# EAGLE design MinieasySens-RS485_V12-Build015 (EAGLE 7.6.0)
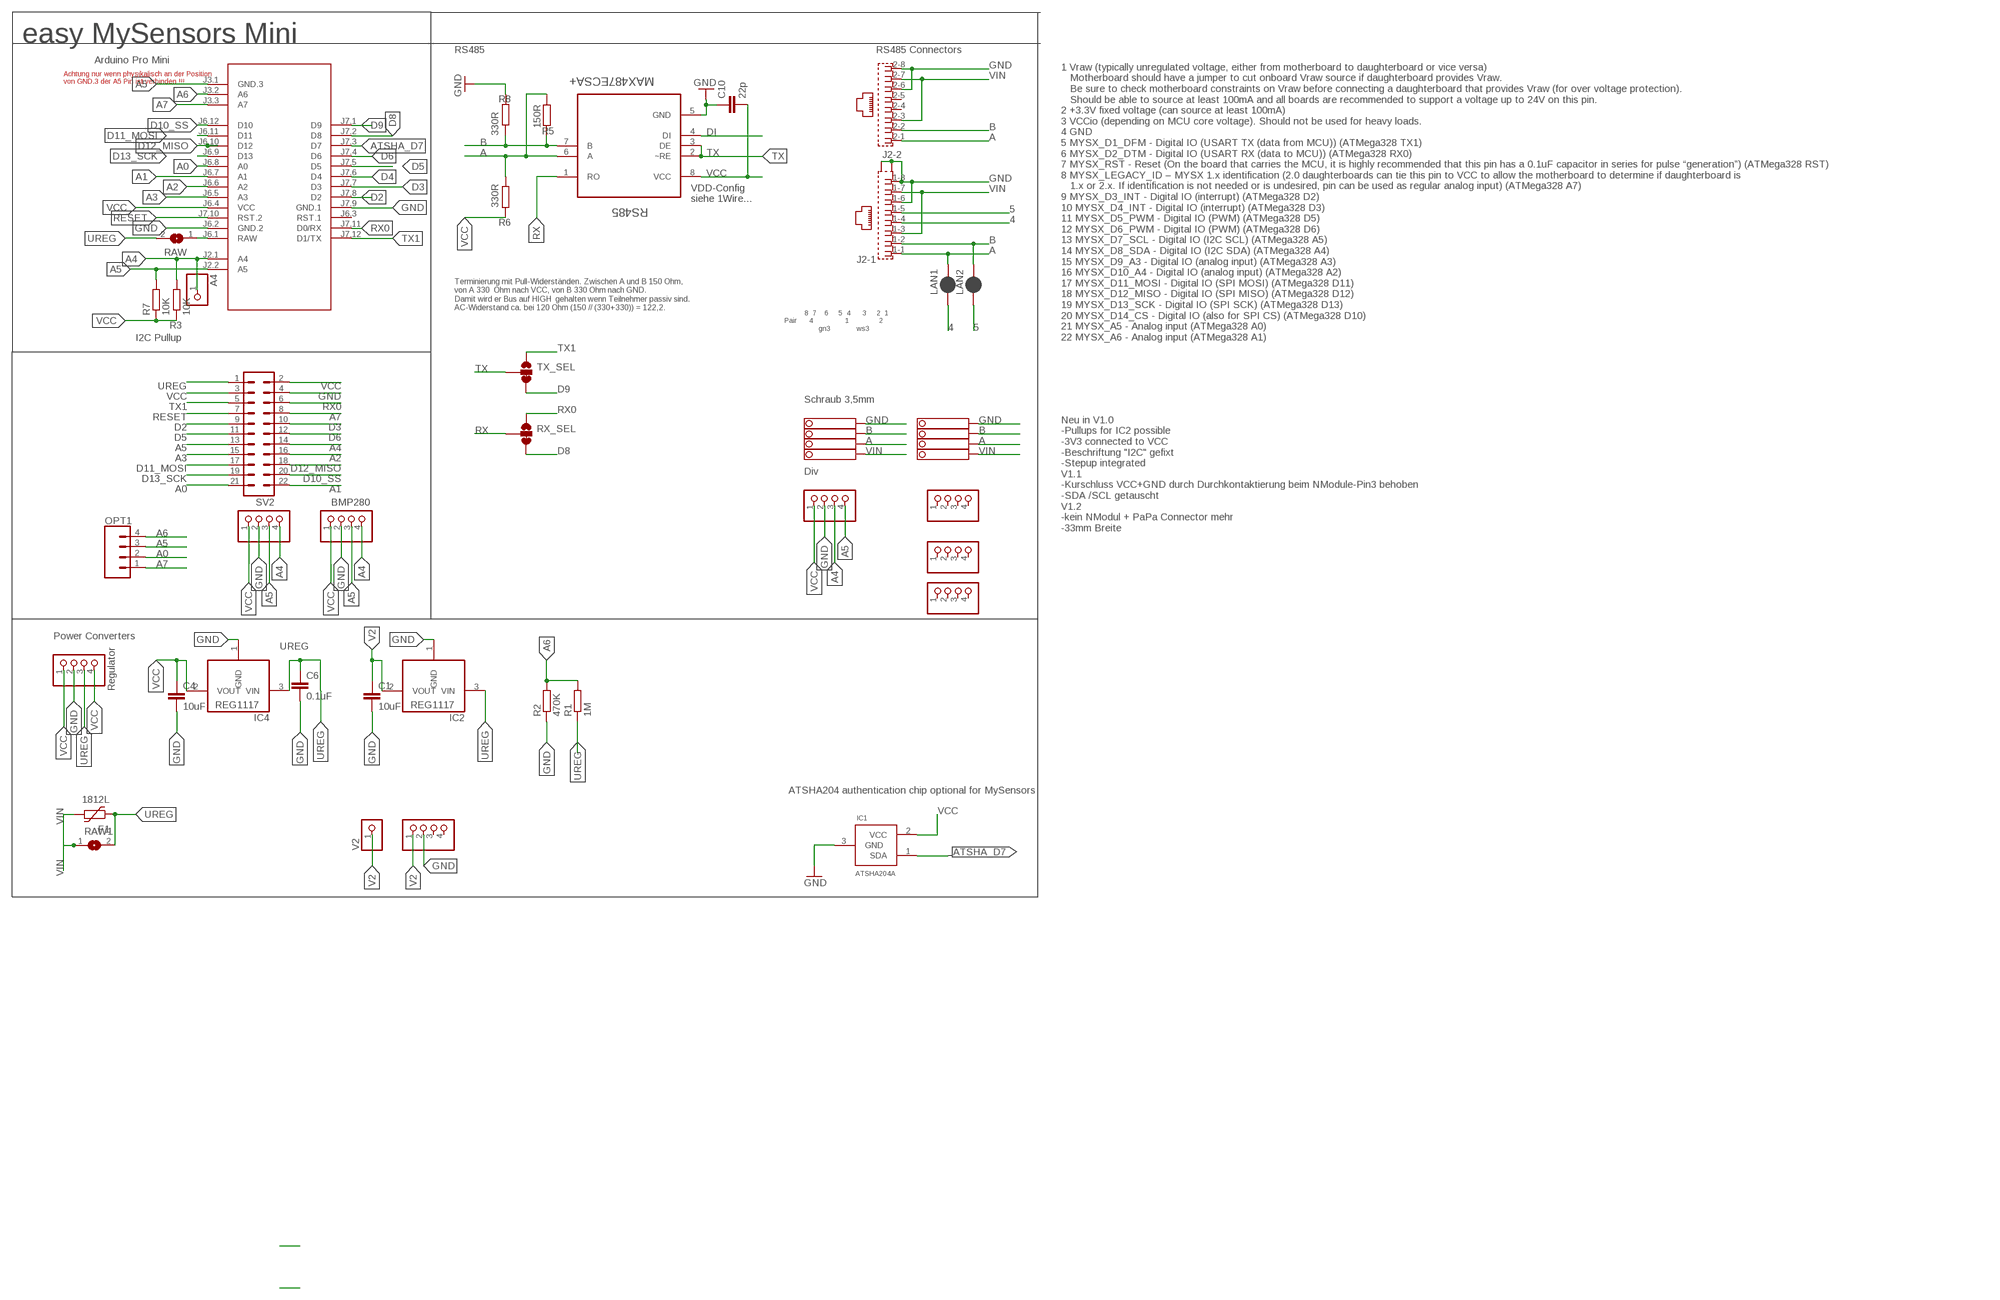
[diagram p0: schematic, sheet 1]

## Parts
A4  PINHD-1X1  [1X01]
BH1750  PINHD-1X04_2.54-S  [1X04-S]
C1  10uF  C-EUC1210  [C1210]
C4  10uF  C-EUC1210  [C1210]
C6  0.1uF  C-EUC1206  [C1206]
C10  22p  C-EUC0805  [C0805]
F1  1812L  [1812L]
I2C-1  PINHD-1X04_2.54-S  [1X04-S]
I2C-2  PINHD-1X04_2.54-S  [1X04-S]
IC1  ATSHA204A  [SOT23]
IC2  REG1117  [SOT223]
IC4  REG1117  [SOT223]
J2  RJ45_2X_NARROW_SHILDPINS_NOCASE  [RJ45_2X_NARROW_SHILDPINS_NOCASE]
JP1  PINHD-1X04_2.54-S  [1X04-S]
JP2  PINHD-1X04_2.54-S  [1X04-S]
JP4  PINHD-1X04_2.54-S  [1X04-S]
LAN1  JUMPER-SMT_2_NC_PASTE_SILK  [SMT-JUMPER_2_NC_PASTE_SILK]
LAN2  JUMPER-SMT_2_NC_PASTE_SILK  [SMT-JUMPER_2_NC_PASTE_SILK]
M1  ARDUINO-PRO-MINI-3.3V#NP  [ARDUINO-PRO-MINI#NP]
OPT1  CONN_04  [1X04]
R1  1M  R-EU_R0805  [R0805]
R2  470K  R-EU_R0805  [R0805]
R3  10K  R-EU_R0805  [R0805]
R5  150R  R-EU_R0805  [R0805]
R6  330R  R-EU_R0805  [R0805]
R7  10K  R-EU_R0805  [R0805]
R8  330R  R-EU_R0805  [R0805]
RAW  SJ  [SJ]
RAW1  SJ  [SJ]
RS485  MAX487ECSA+  [SOIC127P600X175-8N]
RX_SEL  JUMPER-SMT_3_1-NC_TRACE_SILK  [SMT-JUMPER_3_1-NC_TRACE_SILK]
STEPDWN  PINHD-1X04_2.54-S  [1X04-S]
SV2  MA11-2  [MA11-2]
TX_SEL  JUMPER-SMT_3_1-NC_TRACE_SILK  [SMT-JUMPER_3_1-NC_TRACE_SILK]
V2  PINHD-1X1  [1X01]
V2-  PINHD-1X04_2.54-S  [1X04-S]
X1  1751264  [1751264]
X4  1751264  [1751264]

## Nets
4: J2.1-4 LAN1.1
5: J2.1-5 LAN2.1
A: J2.1-1 J2.2-1 LAN1.2 R5.1 R6.2 RS485.6(A) X1.2 X4.2
A0: M1.J6.8(A0) OPT1.2 SV2.21
A1: M1.J6.7(A1) SV2.22
A2: M1.J6.6(A2) SV2.16
A3: M1.J6.5(A3) SV2.15
A4: A4.1 BH1750.4 I2C-1.4 I2C-2.3 M1.J2.1(A4) R3.2 SV2.14
A5: BH1750.3 I2C-1.3 I2C-2.4 M1.J2.2(A5) M1.J3.1(GND.3) OPT1.3 R7.2 SV2.13
A6: M1.J3.2(A6) OPT1.4 R1.2 R2.2
A7: M1.J3.3(A7) OPT1.1 SV2.8
ATSHA_D7: IC1.1(SDA) M1.J7.3(D7)
B: J2.1-2 J2.2-2 LAN2.2 R5.2 R8.1 RS485.7(B) X1.3 X4.3
D2: M1.J7.8(D2) SV2.9
D3: M1.J7.7(D3) SV2.10
D4: M1.J7.6(D4)
D5: M1.J7.5(D5) SV2.11
D6: M1.J7.4(D6) SV2.12
D8: M1.J7.2(D8) RX_SEL.3
D9: M1.J7.1(D9) TX_SEL.3
D10_SS: M1.J6.12(D10) SV2.20
D11_MOSI: M1.J6.11(D11) SV2.17
D12_MISO: M1.J6.10(D12) SV2.18
D13_SCK: M1.J6.9(D13) SV2.19
DI: RS485.4(DI)
GND [PWR]: BH1750.2 C1.2 C4.2 C6.2 C10.1 I2C-1.2 I2C-2.2 IC1.3(GND) IC2.1(GND) IC4.1(GND) J2.1-6 J2.1-8 J2.2-6 J2.2-8 J2.G1(-1:S1) J2.G3(-1:S2) M1.J6.2(GND.2) M1.J7.9(GND.1) R2.1 R8.2 RS485.5(GND) STEPDWN.2 SV2.4 V2-.2 X1.4 X4.4
RAW [PWR]: M1.J6.1(RAW) RAW.1
RESET: M1.J7.10(RST.2) SV2.7
RX: RS485.1(RO) RX_SEL.2
RX0: M1.J7.11(D0/RX) RX_SEL.1 SV2.6
TX: RS485.2(~RE) RS485.3(DE) TX_SEL.2
TX1: M1.J7.12(D1/TX) SV2.5 TX_SEL.1
UREG [PWR]: C6.1 F1.P$1 IC2.3(VIN) IC4.3(VIN) R1.1 RAW1.2 RAW.2 STEPDWN.3 SV2.1
V2 [PWR]: C1.1 IC2.2(VOUT) V2-.1 V2.1
VCC [PWR]: BH1750.1 C4.1 C10.2 I2C-1.1 I2C-2.1 IC1.2(VCC) IC4.2(VOUT) M1.J6.4(VCC) R3.1 R6.1 R7.1 RS485.8(VCC) STEPDWN.1 STEPDWN.4 SV2.2 SV2.3
VIN [PWR]: F1.P$2 J2.1-3 J2.1-7 J2.2-3 J2.2-7 RAW1.1 X1.1 X4.1
Unconnected: J2.2-4 J2.2-5 JP1.1 JP1.2 JP1.3 JP1.4 JP2.1 JP2.2 JP2.3 JP2.4 JP4.1 JP4.2 JP4.3 JP4.4 M1.J6.3(RST.1) V2-.3 V2-.4

## Notes on the sheet
- easy MySensors Mini
- RS485 | RS485 Connectors
- Arduino Pro Mini
- Achtung nur wenn physikalisch an der Position 
  von GND.3 der A5 Pin ist verbinden !!!
- VDD-Config
  siehe 1Wire...
- Terminierung mit Pull-Widerständen. Zwischen A und B 150 Ohm,
  von A 330  Ohm nach VCC, von B 330 Ohm nach GND. 
  Damit wird er Bus auf HIGH  gehalten wenn Teilnehmer passiv sind.
  AC-Widerstand ca. bei 120 Ohm (150 // (330+330)) = 122,2.
- 8  7    6     5  4      3     2  1
  Pair      4                1               2
                   gn3             ws3
- I2C Pullup
- 1 Vraw (typically unregulated voltage, either from motherboard to daughterboard or vice versa)
     Motherboard should have a jumper to cut onboard Vraw source if daughterboard provides Vraw. 
     Be sure to check motherboard constraints on Vraw before connecting a daughterboard that provides Vraw (for over voltage protection). 
     Should be able to source at least 100mA and all boards are recommended to support a voltage up to 24V on this pin.
  2 +3.3V fixed voltage (can source at least 100mA)
  3 VCCio (depending on MCU core voltage). Should not be used for heavy loads.
  4 GND
  5 MYSX_D1_DFM - Digital IO (USART TX (data from MCU)) (ATMega328 TX1)
  6 MYSX_D2_DTM - Digital IO (USART RX (data to MCU)) (ATMega328 RX0)
  7 MYSX_RST - Reset (On the board that carries the MCU, it is highly recommended that this pin has a 0.1uF capacitor in series for pulse “generation”) (ATMega328 RST)
  8 MYSX_LEGACY_ID – MYSX 1.x identification (2.0 daughterboards can tie this pin to VCC to allow the motherboard to determine if daughterboard is 
     1.x or 2.x. If identification is not needed or is undesired, pin can be used as regular analog input) (ATMega328 A7)
  9 MYSX_D3_INT - Digital IO (interrupt) (ATMega328 D2)
  10 MYSX_D4_INT - Digital IO (interrupt) (ATMega328 D3)
  11 MYSX_D5_PWM - Digital IO (PWM) (ATMega328 D5)
  12 MYSX_D6_PWM - Digital IO (PWM) (ATMega328 D6)
  13 MYSX_D7_SCL - Digital IO (I2C SCL) (ATMega328 A5)
  14 MYSX_D8_SDA - Digital IO (I2C SDA) (ATMega328 A4)
  15 MYSX_D9_A3 - Digital IO (analog input) (ATMega328 A3)
  16 MYSX_D10_A4 - Digital IO (analog input) (ATMega328 A2)
  17 MYSX_D11_MOSI - Digital IO (SPI MOSI) (ATMega328 D11)
  18 MYSX_D12_MISO - Digital IO (SPI MISO) (ATMega328 D12)
  19 MYSX_D13_SCK - Digital IO (SPI SCK) (ATMega328 D13)
  20 MYSX_D14_CS - Digital IO (also for SPI CS) (ATMega328 D10)
  21 MYSX_A5 - Analog input (ATMega328 A0)
  22 MYSX_A6 - Analog input (ATMega328 A1)
- Schraub 3,5mm
- Div
- BMP280
- Neu in V1.0
  -Pullups for IC2 possible
  -3V3 connected to VCC
  -Beschriftung "I2C" gefixt
  -Stepup integrated
  V1.1
  -Kurschluss VCC+GND durch Durchkontaktierung beim NModule-Pin3 behoben
  -SDA /SCL getauscht
  V1.2
  -kein NModul + PaPa Connector mehr
  -33mm Breite
- Power Converters
- Regulator
- ATSHA204 authentication chip optional for MySensors

## Library data of the parts
A4 V2 = pinhead:PINHD-1X1: PIN HEADER
BH1750 I2C-1 I2C-2 JP1 JP2 JP4 STEPDWN V2- = pinhead-2:PINHD-1X04: PIN HEADER
C1 C4 C6 C10 = rcl:C-EU: CAPACITOR, European symbol
F1 = ptc-littlefuse:1812L
IC1 = Sensor:ATSHA204A
IC2 IC4 = burr-brown:REG1117: 800mA and 1A Low Dropout (LDO) Positive Regulator 1.8V, 2.5V, 2.85V, 3.3V, 5V, and Adj; MPN: REG1117; OC_FARNELL: 1097566; OC_NEWARK: 14P6981
J2 = RJ45:RJ45_2X_NARROW_SHILDPINS_NOCASE: RJ45 connector
LAN1 LAN2 = SparkFun-Jumpers:JUMPER-SMT_2_NC_PASTE: Normally closed solder jumper This jumper has an aperture in the stencil to allow solder paste to bridge the split in the wire so it's normally closed (NC). Wick off the solder to open the connection. Reapply solder to reclose the connection.
M1 = diy-modules:ARDUINO-PRO-MINI-*#NP: Arduino Pro Mini without programming pads
OPT1 = SparkFun-Connectors:CONN_04: Multi connection point. Often used as Generic Header-pin footprint for 0.1 inch spaced/style header connections On any of the 0.1 inch spaced packages, you can populate with these: Break Away Headers - Straight <https://www.sparkfun.com/products/116> (PRT-00116) Break Away Male Headers - Right Angle <https://www.sparkfun.com/products/553> (PRT-00553) Female Headers <https://www.sparkfun.com/products/115> (PRT-00115) Break Away Headers - Machine Pin <https://www.sparkfun.com/products/117> (PRT-00117) Break Away Female Headers - Swiss Machine Pin <https://www.sparkfun.com/products/743> (PRT-00743) For SCREWTERMINALS and SPRING TERMINALS visit here: Screw Terimnals on SparkFun.com <https://www.sparkfun.com/search/results?term=Screw+Terminals> (5mm/3.5mm/2.54mm spacing) This device is also useful as a general connection point to wire up your design to another part of your project. Our various solder wires solder well into these plated through hole pads. Hook-Up Wire - Assortment (Stranded, 22 AWG) <https://www.sparkfun.com/products/11375> (PRT-11375) Hook-Up Wire - Assortment (Solid Core, 22 AWG) <https://www.sparkfun.com/products/11367> (PRT-11367) View the entire wire category on our website here <https://www.sparkfun.com/categories/141> Special notes: Molex polarized connector foot print use with SKU : PRT-08231 with associated crimp pins and housings. 1MM SMD Version SKU: PRT-10208; PROD_ID: CONN-09696
R1-R3 R5-R8 = rcl:R-EU_: RESISTOR, European symbol
RAW RAW1 = jumper:SJ: SMD solder JUMPER
RS485 = Maxim_By_element14_Batch_1:MAX487ECSA+: Low-Power, Slew-Rate-Limited RS-485/RS-422 Transceivers; MPN: MAX487ECSA+; OC_FARNELL: 9724532; OC_NEWARK: 68K4803; PACKAGE: SOIC-8; SUPPLIER: Maxim
RX_SEL TX_SEL = SparkFun-Jumpers:JUMPER-SMT_3_1-NC_TRACE: Normally closed trace jumper (1 of 2 connections) This jumper has a trace between two pads so it's normally closed (NC). The other connection is normally open (NO). Use a razor knife to open the connection. For best results follow the IPC guidelines for cutting traces: Cutout at least 0.063 mm (0.005 in). Remove all loose material to clean up the cut area. Seal the cut with an approved epoxy. Reapply solder to reclose the connection, or to close the NO connection.
SV2 = con-Pinheader:MA11-2: PIN HEADER; OC_FARNELL: unknown; OC_NEWARK: unknown
X1 X4 = con-phoenix-350:1751264: MKDS 1/ 4-3,5 Printklemme Nennstrom: 10 A Bemessungsspannung: 160 V Raster: 3,5 mm Polzahl: 4 Montageart: Löten Anschlussart: Schraubanschluss Anschlussrichtung vom Leiter zur Platine: 0° Source: http://eshop.phoenixcontact.com .. 1751264.pdf; MPN: 1751264; OC_FARNELL: unknown; OC_NEWARK: 10R0934

## Net classes
0 default: width 0.254 mm, clearance 0.205 mm
1 PWR: width 0.406 mm, clearance 0.205 mm to class 0, clearance 0.205 mm

## Board
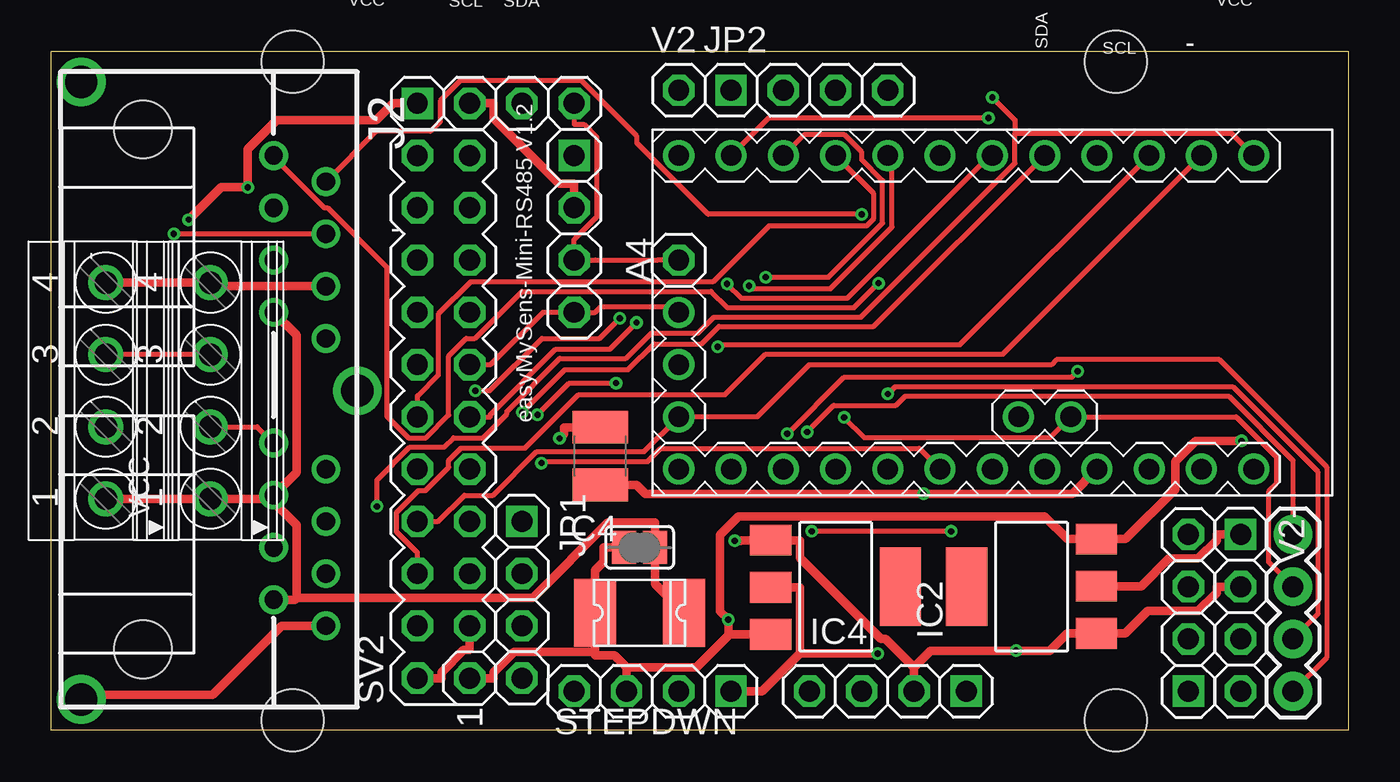
[diagram p1: board, top side]
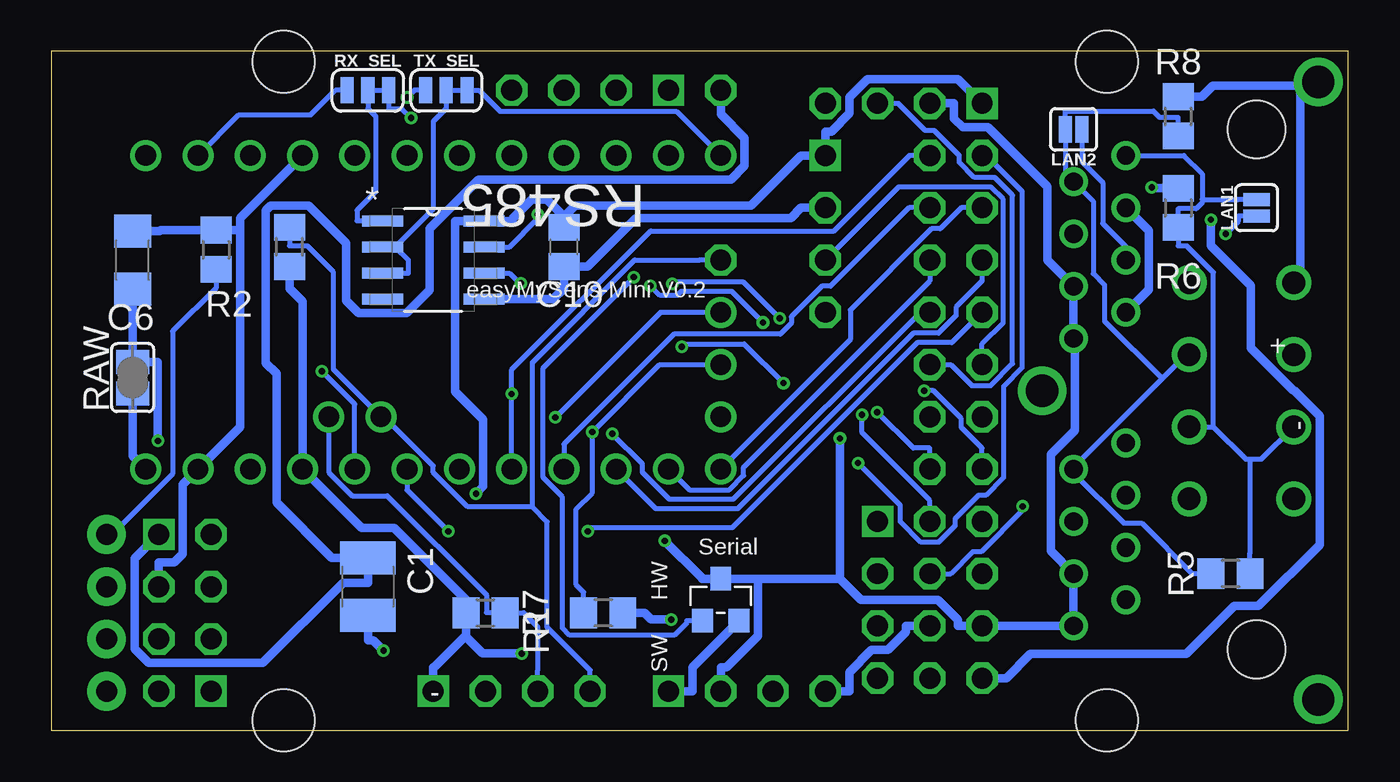
[diagram p2: board, bottom side, seen from below]

Size 63 x 33 mm. Coordinates in mm from the lower left corner, seen from the top.
Outline: 63,0 0,0 0,33 63,33 63,0
Copper layers (1*16): Top 0.035mm / dielectric 1.5mm / Bottom 0.035mm
Design rules "dirt_cheap_dirty_boards.v1": minimum track width 5mil, minimum drill 12mil, track to track 5mil, track to pad 5mil, pad to pad 5mil, via to via 5mil, smd to smd 0mil, copper to edge 10mil, drill to drill 10mil, minimum pad ring 10mil, minimum via ring 6mil, stop-mask expansion 2mil, vias tented up to drill 25mil, thermal gap 10mil
Holes 3 mm at 11.72,32.5 11.72,0.5 51.72,32.5 51.72,0.5
Holes 2 mm at 67.98,34.91
tRestrict: area 3.8,32.4 to 62.9,33; area 4.4,0 to 62.9,1.3; 2 lines
bRestrict: area 3.8,32.4 to 62.9,33; area 4.4,0 to 62.9,1.3; 2 lines

### Footprints (pad centres in the part's own frame; a part is rotated, then mirrored left to right if it is on the bottom)
1X01 = drill 1.016 octagon: 1 0,0
1X04-S = drill 1.016 square: 1 -3.81,0 | drill 1.016 octagon: 2 -1.27,0; 3 1.27,0; 4 3.81,0
C1210 = smd 1.6 x 2.7: 1 -1.4,0; 2 1.4,0
C1206 = smd 1.6 x 1.8: 1 -1.4,0; 2 1.4,0
C0805 = smd 1.3 x 1.5: 1 -0.95,0; 2 0.95,0
1812L = smd 2.03 x 3.3: P$1 -2.16,0; P$2 2.16,0
SOT23 = smd 1.016 x 1.143: 1 -0.889,-1.016; 2 0.889,-1.016; 3 0,1.016
SOT223 = smd 1.499 x 2.007: 1 -2.261,-3.15; 2 0.025,-3.15; 3 2.311,-3.15 | smd 3.81 x 2.007: 4 0,3.15
RJ45_2X_NARROW_SHILDPINS_NOCASE = drill 0.889: 1-1 -11.43,6.35; 1-2 -10.16,8.89; 1-3 -8.89,6.35; 1-4 -7.62,8.89; 1-5 -6.35,6.35; 1-6 -5.08,8.89; 1-7 -3.81,6.35; 1-8 -2.54,8.89; 2-1 2.54,6.35; 2-2 3.81,8.89; 2-3 5.08,6.35; 2-4 6.35,8.89; 2-5 7.62,6.35; 2-6 8.89,8.89; 2-7 10.16,6.35; 2-8 11.43,8.89 | drill 1.575 pad 2.184: G1 -15,-3; G2 0,10.414; G3 15,-3 | hole 2.8: -12.7,0; 12.573,0
SMT-JUMPER_2_NC_PASTE_SILK = smd 0.635 x 1.27: 1 -0.406,0; 2 0.406,0
ARDUINO-PRO-MINI#NP = drill 1: J2.1 -1.27,5.08; J2.2 -3.81,5.08; J3.1 15.24,0; J3.2 15.24,2.54; J3.3 15.24,5.08; J6.1 -12.7,7.62; J6.2 -10.16,7.62; J6.3 -7.62,7.62; J6.4 -5.08,7.62; J6.5 -2.54,7.62; J6.6 0,7.62; J6.7 2.54,7.62; J6.8 5.08,7.62; J6.9 7.62,7.62; J6.10 10.16,7.62; J6.11 12.7,7.62; J6.12 15.24,7.62; J7.1 15.24,-7.62; J7.2 12.7,-7.62; J7.3 10.16,-7.62; J7.4 7.62,-7.62; J7.5 5.08,-7.62; J7.6 2.54,-7.62; J7.7 0,-7.62; J7.8 -2.54,-7.62; J7.9 -5.08,-7.62; J7.10 -7.62,-7.62; J7.11 -10.16,-7.62; J7.12 -12.7,-7.62
1X04 = drill 1.016 pad 1.88: 1 0,0; 2 2.54,0; 3 5.08,0; 4 7.62,0
R0805 = smd 1.3 x 1.5: 1 -0.95,0; 2 0.95,0
SJ = smd 1.168 x 1.6: 1 -0.762,0; 2 0.762,0
SOIC127P600X175-8N = smd 1.981 x 0.533: 1 -2.464,1.905; 2 -2.464,0.635; 3 -2.464,-0.635; 4 -2.464,-1.905; 5 2.464,-1.905; 6 2.464,-0.635; 7 2.464,0.635; 8 2.464,1.905
SMT-JUMPER_3_1-NC_TRACE_SILK = smd 0.635 x 1.27: 1 -1.016,0; 2 0,0; 3 1.016,0
MA11-2 = drill 1.016 octagon: 1 -12.7,-1.27; 2 -12.7,1.27; 3 -10.16,-1.27; 4 -10.16,1.27; 5 -7.62,-1.27; 6 -7.62,1.27; 7 -5.08,-1.27; 8 -5.08,1.27; 9 -2.54,-1.27; 10 -2.54,1.27; 11 0,-1.27; 12 0,1.27; 13 2.54,-1.27; 14 2.54,1.27; 15 5.08,-1.27; 16 5.08,1.27; 17 7.62,-1.27; 18 7.62,1.27; 19 10.16,-1.27; 20 10.16,1.27; 21 12.7,-1.27; 22 12.7,1.27
1751264 = drill 1.1 pad 1.7: 1 -5.25,-0.1; 2 -1.75,-0.1; 3 1.75,-0.1; 4 5.25,-0.1

### Placement (x,y rotation side)
A4  30.48,22.86 90 top
BH1750  21.59,30.48 0 top
C1  47.62,6.99 270 bottom
C4  26.67,13.34 90 top
C6  59.05,22.86 90 bottom
C10  38.1,23.5 90 bottom
F1  28.57,5.71 0 top
I2C-1  40.64,1.91 180 top
I2C-2  25.4,24.13 270 top
IC1  30.48,6.35 0 bottom
IC2  47.62,6.99 90 top
IC4  38.1,6.99 270 top
J2  4.45,16.51 270 top
JP1  22.86,6.35 270 top
JP2  36.83,31.11 0 top
JP4  55.24,5.71 90 top
LAN1  4.45,25.4 90 bottom
LAN2  13.34,29.21 180 bottom
M1  45.72,20.32 180 top
OPT1  60.33,1.91 90 top
R1  36.2,5.71 180 bottom
R2  55,23.36 270 bottom
R3  51.44,23.5 90 bottom
R5  5.71,7.62 180 bottom
R6  8.26,25.4 270 bottom
R7  41.91,5.71 0 bottom
R8  8.26,29.84 90 bottom
RAW  59.05,17.14 90 bottom
RAW1  28.57,8.89 180 top
RS485  44.45,22.86 0 bottom
RX_SEL  47.62,31.11 0 bottom
STEPDWN  29.21,1.91 180 top
SV2  19.05,15.24 90 top
TX_SEL  43.81,31.11 0 bottom
V2  30.48,31.11 0 top
V2-  57.78,5.71 270 top
X1  2.54,16.51 90 top
X4  7.62,16.51 90 top

### Tracks (layer width: path | path; a pad name or v marks a point on that pad's centre or on a via)
4  (via drill 0.3 pad 0.61)
  Top 0.254: J2.1-4 v5.94,24.13
  Bottom 0.254: v5.94,24.13 5.33,24.74 5.33,24.99 LAN1.1
5
  Bottom 0.254: J2.1-5 10.79,23.51 11.92,24.63 11.92,26.63 12.93,27.64 12.93,28.32 LAN2.1
A  (via drill 0.3 pad 0.61)
  Top 0.254: J2.1-1 10.79,27.86 13.26,25.4 13.42,25.4 16.29,22.52 16.29,15.28 17.35,14.22 18.2,14.22 19.3,15.33 19.3,18.2 20.15,19.05 20.57,19.05 22.86,21.34 32.06,21.34 32.85,20.55 39,20.55 v40.19,21.74 | X4.2 10.01,14.76 J2.2-1
  Bottom 0.254: v40.19,21.74 40.25,21.74 40.74,22.23 RS485.6 | 7.08,25.81 7.08,25.65 7.38,25.35 8.26,25.35 R6.2 8.26,23.55 7.83,23.55 6.54,22.25 6.54,14.76 | J2.1-1 7.97,27.94 7.08,27.05 7.08,25.81 | 7.08,25.81 5.33,25.81 LAN1.2 | 4.76,13.19 4.21,13.19 X1.2 | 6.54,14.76 4.97,13.19 4.76,13.19 | 4.76,13.19 4.76,8.62 R5.1 | X4.2 6.54,14.76
A0  (via drill 0.3 pad 0.61)
  Top 0.254: v40.64,16.35 41,16.71 57.39,16.71 61.52,12.58 61.52,5.64 OPT1.2
  Bottom 0.254: M1.J6.8 v40.64,16.35 40.64,17.53 33.89,24.28 24.97,24.28 21.34,27.91 21.34,27.94 SV2.21
A1  (via drill 0.3 pad 0.61)
  Top 0.254: v23.81,12.99 23.89,13.07 28.96,13.07 29.6,13.71 42.17,13.71 M1.J6.7
  Bottom 0.254: SV2.22 17.57,27.94 15.84,26.21 15.84,17.63 16.74,16.73 16.74,12.29 17.61,11.43 17.95,11.43 19.09,10.29 19.09,9.95 19.9,9.14 20.74,9.14 21.75,10.15 21.75,10.94 v23.81,12.99
A2  (via drill 0.3 pad 0.61)
  Top 0.254: v43.71,9.68 v36.94,9.68
  Bottom 0.254: SV2.16 19.25,18.84 20.93,18.84 29.93,9.85 36.77,9.85 v36.94,9.68 | M1.J6.6 45.72,11.68 v43.71,9.68
A3  (via drill 0.3 pad 0.61)
  Top 0.254: v35.75,14.42 38.51,17.17 49.57,17.17 v49.85,17.45
  Bottom 0.254: M1.J6.5 48.26,15.86 v49.85,17.45 | SV2.15 20.78,20.32 29.88,11.23 32.97,11.23 34.29,12.54 34.29,12.95 v35.75,14.42
A4
  Top 0.254: A4.1 29.46,22.86 26.42,22.86 I2C-2.3 25.4,23.88 25.43,23.88 26.5,24.95 26.5,28.84 25.88,29.46 25.4,29.46 BH1750.4
  Bottom 0.254: 39.63,10.86 39.63,17.89 34.66,22.86 31.5,22.86 A4.1 | 39.63,10.86 38.91,10.14 38.91,5 36.83,2.92 I2C-1.4 | SV2.14 17.78,18.8 16.76,19.82 16.76,25.82 17.36,26.42 21.84,26.42 I2C-2.3 | 39.63,10.86 42.77,10.86 44.45,12.54 44.45,12.86 46.83,15.24 M1.J2.1 49.29,17.54 49.29,22.27 50.56,23.54 51.44,23.54 R3.2
A5  (via drill 0.3 pad 0.61)
  Top 0.254: M1.J3.1 30.21,20.59 26.68,20.59 26.42,20.32 I2C-2.4 24.38,20.32 23.88,20.32 21.34,17.78 SV2.13 | OPT1.3 59.13,8.18 59.13,11.61 59.51,11.99 59.51,13.3 57.56,15.24 M1.J2.2 48.52,14.23 39.5,14.23 v38.52,15.21
  Bottom 0.254: M1.J3.1 33.41,20.32 v38.52,15.21 | BH1750.3 21.84,30.48 21.84,30.45 20.55,29.16 20.1,29.16 18.89,27.95 18.89,27.61 18.15,26.88 17.16,26.88 16.3,26.01 16.3,17.82 17.36,16.76 18.29,16.76 19.3,17.78 SV2.13 | M1.J2.2 49.53,12.54 48.39,11.41 46.68,11.41 41.86,6.59 41.86,5.71 R7.2 40.06,5.71 39.37,5.03 39.37,2.92 I2C-1.3
A6  (via drill 0.3 pad 0.61)
  Top 0.254: v36.72,14.5 38.01,15.79 41.02,15.79 41.48,16.25 57.2,16.25 60.33,13.13 OPT1.4
  Bottom 0.254: M1.J3.2 33.44,17.78 v36.72,14.5 36.72,11.54 37.51,10.76 37.51,7.08 37.15,6.72 R1.2 | OPT1.4 60.06,9.53 57.11,12.47 57.11,19.4 55,21.51 R2.2
A7
  Top 0.254: OPT1.1 61.98,3.56 61.98,12.77 56.73,18.02 48.83,18.02 48.58,17.76 36.81,17.76 34.29,15.24 M1.J3.3 28.79,13.55 23.58,13.55 21.46,11.43 20.07,11.43 18.8,10.16 SV2.8
ATSHA_D7  (via drill 0.3 pad 0.61)
  Top 0.254: v34.7,22.03 37.76,22.03 40.39,24.66 40.39,26.72 39.37,27.74 39.37,28.1 38.52,28.95 36.57,28.95 M1.J7.3
  Bottom 0.254: v34.7,22.03 39.11,17.62 39.11,12.29 38.17,11.35 38.17,4.98 37.82,4.63 32.73,4.63 32.13,5.24 32.13,5.33 IC1.1
B  (via drill 0.3 pad 0.61)
  Top 0.254: v39.37,25.08 31.9,25.08 28.44,28.54 28.44,28.88 25.74,31.58 19.86,31.58 18.89,30.6 18.89,29.59 18.41,29.12 15.78,29.12 J2.1-2 | X4.3 X1.3
  Bottom 0.254: v39.37,25.08 39.37,24.87 40.74,23.5 RS485.7 | R5.2 7.57,7.62 10.03,10.08 10.9,10.08 13.34,12.51 J2.2-2 13.34,12.78 9.03,17.09 | X4.3 7.86,18.26 9.03,17.09 | 9.03,17.09 11.83,19.9 11.83,21.65 12.38,22.2 12.38,25.72 J2.1-2 13.74,27.08 LAN2.2 13.74,30.1 9.46,30.1 9.16,29.8 8.26,29.8 R8.1
D2  (via drill 0.3 pad 0.61)
  Top 0.254: v22.88,15.47 24.95,17.54 28.02,17.54 29.27,18.79 31.59,18.79 32.43,19.63 39.95,19.63 M1.J7.8
  Bottom 0.254: v22.88,15.47 21.13,13.72 20.32,13.72 SV2.9
D3  (via drill 0.3 pad 0.61)
  Top 0.254: v32.83,21.7 33.52,21.01 38.67,21.01 45.6,27.94 M1.J7.7 | v20.59,16.51 21.29,16.51 23.83,19.05 26.63,19.05 v27.61,20.03
  Bottom 0.254: SV2.10 17.78,13.72 18.8,14.73 18.8,15.16 20.15,16.51 v20.59,16.51 | v27.61,20.03 29.37,21.79 32.74,21.79 v32.83,21.7
D5  (via drill 0.3 pad 0.61)
  Top 0.254: 27.14,18.53 24.5,18.53 21.34,15.37 21.34,15.24 SV2.11 | 27.14,18.53 | 27.14,18.53 v28.43,19.82 | v33.89,21.61 34.03,21.47 37.85,21.47 40.85,24.47 40.85,27.73 M1.J7.5
  Bottom 0.254: v28.43,19.82 29.93,21.33 32.41,21.33 32.6,21.14 33.42,21.14 v33.89,21.61
D6
  Top 0.254: M1.J7.4 39.93,26.11 39.93,24.85 39.6,24.52 34.86,24.52 32.14,21.8 20.36,21.8 18.8,20.23 18.8,17.27 17.78,16.26 SV2.12
D8  (via drill 0.3 pad 0.61)
  Top 0.254: M1.J7.2 34.85,29.77 v45.52,29.77
  Bottom 0.254: RX_SEL.3 46.61,30.23 45.98,30.23 v45.52,29.77
D9
  Bottom 0.254: TX_SEL.3 42.23,31.11 41.21,30.09 32.63,30.09 M1.J7.1
D10_SS
  Bottom 0.254: M1.J6.12 24.18,19 24.18,20.44 20.23,24.38 19.81,24.38 18.8,25.4 SV2.20
D11_MOSI
  Bottom 0.254: M1.J6.11 32.01,11.69 30.07,11.69 29.37,12.38 29.37,12.79 20.32,21.84 SV2.17
D12_MISO
  Bottom 0.254: M1.J6.10 33.63,10.77 29.66,10.77 21.12,19.3 19.9,19.3 19.05,20.15 19.05,20.57 17.78,21.84 SV2.18
D13_SCK
  Bottom 0.254: M1.J6.9 38.1,13.92 32.75,19.26 27.59,19.26 27.05,19.8 27.05,20.11 25.57,21.59 25.15,21.59 21.34,25.4 SV2.19
GND  (via drill 0.3 pad 0.61)
  Top 0.406: v24.69,14.19 24.91,14.41 24.91,14.73 C4.2 | 41.91,3.08 40.53,4.45 40.29,4.45 36.36,8.38 36.36,9.25 IC4.1 33.54,9.25 33.51,9.21 v33.2,9.21 | 41.91,3.08 42.71,3.87 v46.86,3.87 48.51,3.87 49.36,4.72 IC2.1 52.19,4.72 53.28,5.82 55.74,5.82 56.62,6.69 56.62,6.99 V2-.2 | X1.4 X4.4 7.89,21.59 J2.1-6 | J2.G3 1.67,1.73 7.83,1.73 11.18,5.08 J2.2-8 | I2C-2.2 25.4,26.57 24.67,26.57 21.49,29.75 21.49,30.48 BH1750.2 | I2C-1.2 41.91,3.08
  Bottom 0.406: 24.69,7.37 v24.69,14.19 | 28.67,7.37 29.56,7.37 IC1.3 31.4,7.37 31.4,7.41 v33.2,9.21 | 24.69,7.37 28.67,7.37 | 28.67,7.37 28.67,4.59 30.19,3.08 30.48,3.08 STEPDWN.2 | 24.69,7.37 23.67,6.35 19.93,6.35 18.95,5.37 18.95,5.08 SV2.4 16.61,5.08 J2.2-8 J2.2-6 14.44,8.73 14.44,13.41 13.27,14.59 13.27,18.98 J2.1-8 J2.1-6 14.61,22.86 14.61,26.42 17.49,29.31 18.72,29.31 19.15,29.74 19.15,30.48 BH1750.2 | 53.84,24.32 53.84,14.74 M1.J6.2 56.62,11.96 56.62,8.59 57.04,8.15 57.78,8.15 V2-.2 | 53.84,24.32 53.99,24.32 R2.1 57.69,24.32 57.75,24.26 C6.2 | 53.84,24.32 53.84,24.9 M1.J7.9 | C1.2 47.62,4.38 47.37,4.38 v46.86,3.87 | RS485.5 40.59,20.95 38.63,20.95 38.1,21.49 C10.1 36.94,22.55 34.59,24.89 27.08,24.89 26.57,25.4 I2C-2.2 | 2.33,31.33 2.33,22.07 X1.4 | J2.G1 2.15,31.51 2.33,31.33 | 2.33,31.33 6.57,31.33 7.1,30.8 R8.2
RAW
  Bottom 0.406: M1.J6.1 59.05,13.34 59.05,15.39 RAW.1
RESET  (via drill 0.3 pad 0.61)
  Top 0.254: v23.62,15.34 25.16,16.88 v27.43,16.88 | v32.38,18.65 32.48,18.75 44.15,18.75 M1.J7.10
  Bottom 0.254: v32.38,18.65 32.24,18.79 29.34,18.79 v27.43,16.88 | v23.62,15.34 23.62,14.47 20.32,11.18 SV2.7
RX
  Bottom 0.254: RX_SEL.2 47.62,30.23 47.25,29.85 47.25,26.2 48.16,25.29 48.16,24.77 RS485.1
RX0
  Top 0.254: M1.J7.11 46.23,18.29 34.7,18.29 32.73,16.32 25.62,16.32 23.01,13.72 19.9,13.72 19.3,13.13 19.3,12.79 18.18,11.66 17.84,11.66 16.76,10.58 16.76,9.66 17.78,8.64 SV2.6
  Bottom 0.254: RX_SEL.1 49.21,31.11 50.4,29.92 53.9,29.92 M1.J7.11
TX
  Bottom 0.254: 46.29,23.5 44.45,25.34 44.45,29.59 43.81,30.23 TX_SEL.2 | 46.29,23.5 45.67,22.87 45.67,22.23 RS485.3 | RS485.2 46.29,23.5
TX1  (via drill 0.3 pad 0.61)
  Top 0.254: v15.81,10.89 15.81,12.17 17.41,13.77 19.07,13.77 19.53,14.22 20.97,14.22 22.13,15.38 22.13,15.51 24.7,18.07 27.91,18.07 29.14,19.31 31.41,19.31 32.19,20.09 39.33,20.09 46.81,27.57 46.81,29.03 | v45.72,30.76 46.81,29.67 46.81,29.03 | 46.81,29.03 57.33,29.03 M1.J7.12
  Bottom 0.254: SV2.5 19.3,7.62 18.24,8.68 17.82,8.68 15.81,10.69 v15.81,10.89 | TX_SEL.1 45.4,31.11 45.4,31.08 v45.72,30.76
UREG  (via drill 0.3 pad 0.61)
  Top 0.406: 32.88,4.67 v32.88,5.39 32.49,5.79 32.49,9.51 33.39,10.4 48.26,10.4 49.36,9.3 IC2.3 52.19,9.3 54.61,11.72 54.61,13.08 55.6,14.07 v57.83,14.07 | 27.94,3.08 31.34,3.08 32.88,4.62 32.88,4.67 | 32.88,4.67 33.54,4.67 IC4.3 | 27.94,3.08 27.36,3.66 26.41,3.66 26.41,3.81 | SV2.1 21.49,2.54 21.49,2.83 22.47,3.81 26.41,3.81 | 26.41,3.81 F1.P$1 26.41,7.77 26.82,8.18 26.82,8.89 RAW1.2 | STEPDWN.3 27.94,3.08
  Bottom 0.406: v57.83,14.07 57.85,14.09 57.85,17.91 RAW.2 C6.1 | R1.1 34.19,5.71 33.86,5.39 v32.88,5.39
V2
  Top 0.406: IC2.2 52.95,7.01 54.29,8.36 55.74,8.36 56.62,9.23 56.62,9.53 V2-.1
  Bottom 0.406: V2.1 30.48,29.95 29.32,28.78 29.32,27.45 29.99,26.78 42.24,26.78 44.63,24.39 44.63,21.4 45.75,20.28 48.07,20.28 48.69,20.9 48.69,23.69 50.51,25.5 52.36,25.5 52.6,25.26 52.6,17.87 52.07,17.34 52.07,11.07 49.38,8.38 C1.1 47.62,7.18 48.83,7.18 52.74,3.27 58.27,3.27 58.96,3.96 58.96,8.35 V2-.1
VCC  (via drill 0.3 pad 0.61)
  Top 0.406: v6.66,24.82 8.24,26.4 v9.54,26.4 9.54,28.25 10.94,29.65 15.78,29.65 16.61,30.48 BH1750.1 | C4.1 28.43,11.94 28.86,11.51 v42.37,11.51 49.6,11.51 M1.J6.4 | SV2.2 18.95,2.54 18.95,2.83 20.03,3.91 20.32,3.91 SV2.3 | 36.36,3.75 34.52,1.91 STEPDWN.1 | 36.36,3.75 36.36,6.96 IC4.2 | 36.36,3.75 40.13,3.75 v40.14,3.74
  Bottom 0.406: 38.1,24.97 38.92,25.8 39.66,25.8 40.59,24.87 40.59,24.77 RS485.8 43.38,24.77 43.38,16.47 42.02,15.11 42.02,11.86 v42.37,11.51 | STEPDWN.4 24.23,1.91 24.23,2.83 23.15,3.91 22.37,3.91 21.49,4.79 21.49,5.08 SV2.3 | R6.1 9.41,26.35 9.46,26.4 v9.54,26.4 | SV2.2 16.61,2.54 15.44,3.71 7.86,3.71 5.52,6.05 4.36,6.05 1.38,9.03 1.38,15.28 2.61,16.51 2.67,16.51 4.73,18.57 4.73,21.62 6.66,23.55 v6.66,24.82 | BH1750.1 18.95,31.65 23.34,31.65 24.23,30.77 24.23,29.99 25.11,29.11 25.4,29.11 I2C-2.1 26.57,27.94 29.01,25.5 37.57,25.5 38.1,24.97 | C10.2 38.1,24.97 | I2C-1.1 44.45,3.08 44.4,3.08 42.86,4.62 | 42.86,4.62 42.86,4.56 42.04,3.74 v40.14,3.74 | 42.86,4.62 R7.1 42.86,6.35 46.35,9.84 47.94,9.84 M1.J6.4 50.8,20.85 51.44,21.49 R3.1 | IC1.2 31.85,3.08 31.85,1.91 STEPDWN.1
VIN
  Top 0.406: J2.1-7 11.9,19.21 11.9,12.54 J2.2-3 10.62,11.26 | 11.9,6.45 23.4,6.45 27.05,10.1 29.34,10.1 RAW1.1 29.34,7.11 F1.P$2 | J2.2-7 11.8,6.35 11.9,6.45 | 11.9,6.45 11.9,9.98 10.62,11.26 | 10.62,11.26 X4.1 X1.1
  Bottom 0.406: J2.1-7 9.69,21.43 9.69,24.29 J2.1-3

### Text on the board
tPlace: easyMySens-Mini-RS485 V1.2
bPlace: easyMySens-Mini V0.2
tNames: SCL | SDA | VCC | - | SDA | VCC | - | SCL | - | - | VCC
bNames: + | - | Serial | HW | SW | -
tValues: Gehäuse: RND 455‑00307